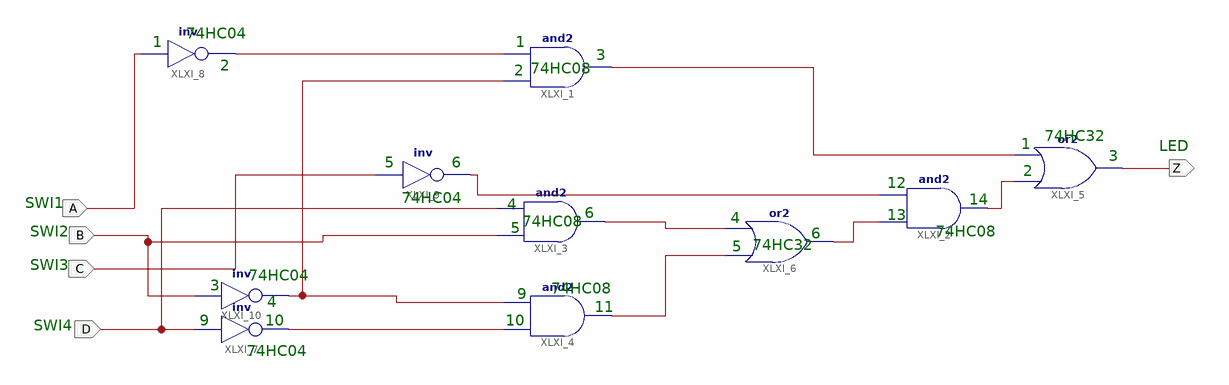
[diagram p0: schematic sheet 1]
// Xilinx ISE schematic p1ej2a.sch (spartan3) as structural Verilog: 10 symbols, 5 ports
module p1ej2a (
  input  A,
  input  B,
  input  C,
  input  D,
  output Z
);

  wire XLXN_1, XLXN_3, XLXN_4, XLXN_6, XLXN_8, XLXN_10, XLXN_11, XLXN_13, XLXN_14;

  and XLXI_1 (XLXN_14, XLXN_3, XLXN_4);
  and XLXI_3 (XLXN_8, B, D);
  and XLXI_4 (XLXN_6, XLXN_1, XLXN_3);
  or XLXI_5 (Z, XLXN_13, XLXN_14);
  or XLXI_6 (XLXN_11, XLXN_6, XLXN_8);
  not XLXI_7 (XLXN_1, D);
  not XLXI_9 (XLXN_10, C);
  not XLXI_10 (XLXN_3, B);
  and XLXI_2 (XLXN_13, XLXN_11, XLXN_10);
  not XLXI_8 (XLXN_4, A);

  // Notes on the sheet:
  //   74HC04
  //   1
  //   1
  //   3
  //   2
  //   74HC08
  //   2
  //   74HC32
  //   1
  //   LED
  //   3
  //   5
  //   6
  //   2
  //   12
  //   74HC04
  //   14
  //   SWI1
  //   4
  //   6
  //   13
  //   4
  //   74HC08
  //   5
  //   SWI2
  //   74HC08
  //   6
  //   74HC32
  //   5
  //   SWI3
  //   74HC04
  //   3
  //   74HC08
  //   9
  //   4
  //   11
  //   9
  //   10
  //   10
  //   SWI4
  //   74HC04
endmodule
